# Altium schematic sheet Sheet2.SchDoc
size A4; SheetNumber: 2; SheetTotal: 3
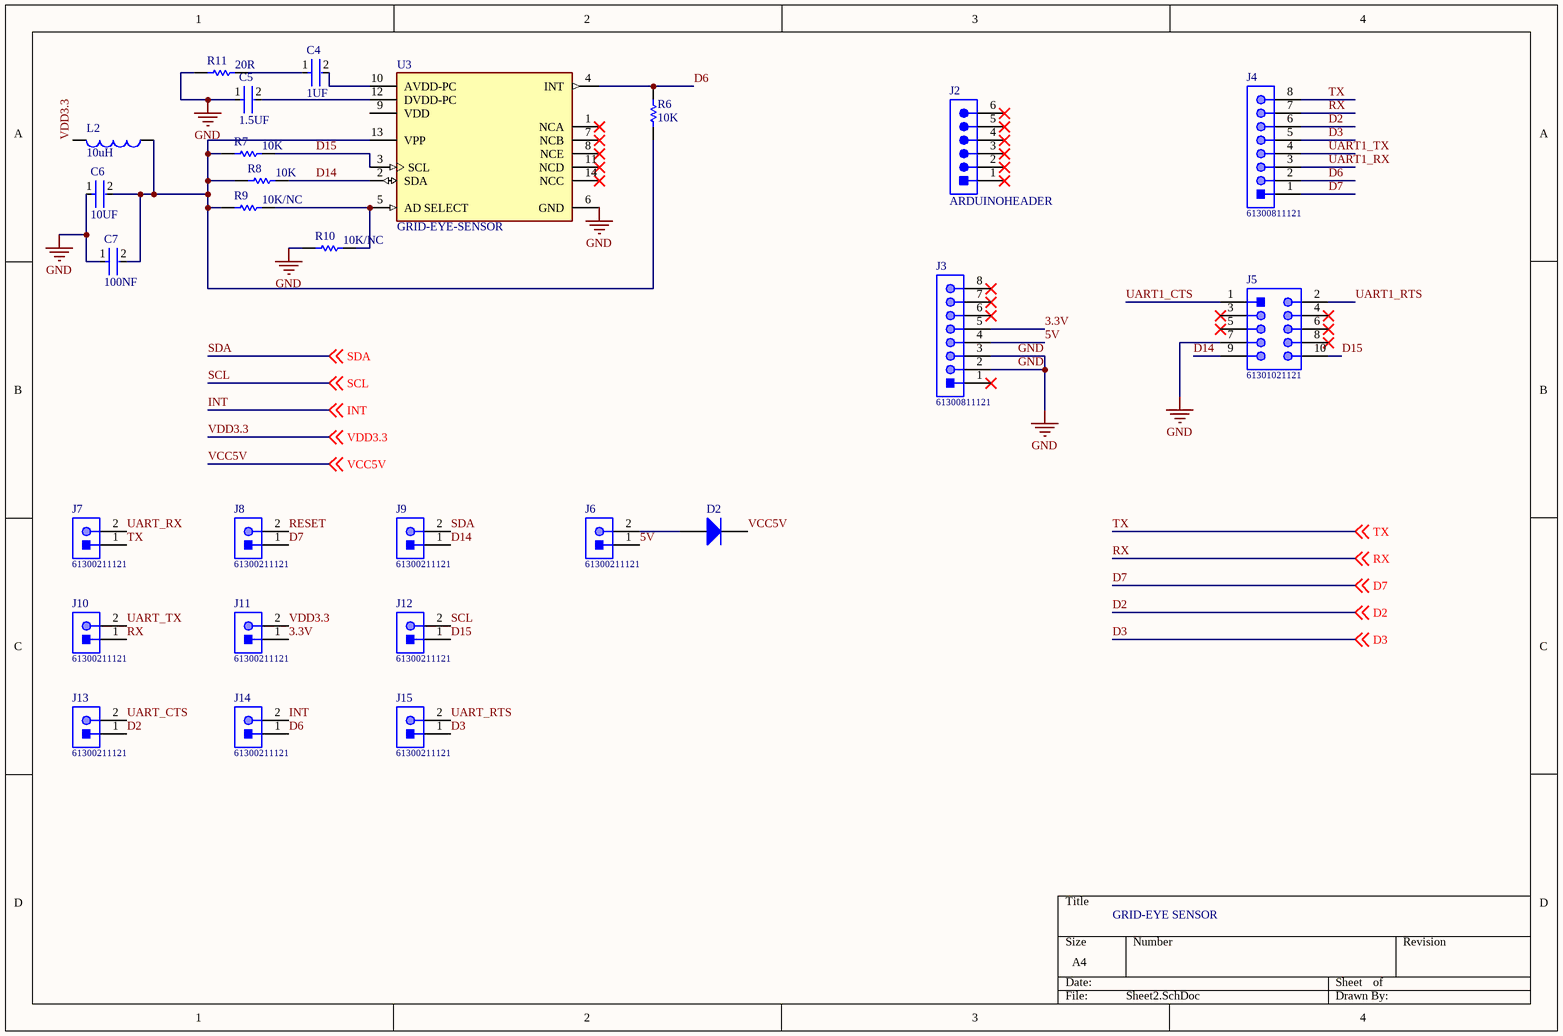
[diagram p0: Sheet2.SchDoc]

## Parts
C4  1UF  [FP-C0805C-DN-MFG]
C5  1.5UF  [FP-C0805C-DN-MFG]
C6  10UF  [FP-C0805C-DN-MFG]
C7  100NF  [FP-C0805C-DN-MFG]
D2  1N4148W-7-F  [DIOD-SOD123-2_V]  (value not drawn)
J2  ARDUINOHEADER  [TECO-640456-6_V]
J3  61300811121  [61300811121]
J4  61300811121  [61300811121]
J5  61301021121  [61301021121]
J6  61300211121  [61300211121]
J7  61300211121  [61300211121]
J8  61300211121  [61300211121]
J9  61300211121  [61300211121]
J10  61300211121  [61300211121]
J11  61300211121  [61300211121]
J12  61300211121  [61300211121]
J13  61300211121  [61300211121]
J14  61300211121  [61300211121]
J15  61300211121  [61300211121]
L2  value 10uH  [0402-A]  (hidden comment: Inductor)
R6  10K  [RESC1005X40X25NL05T10]
R7  10K  [RESC1005X40X25NL05T10]
R8  10K  [RESC1005X40X25NL05T10]
R9  10K/NC  [RESC1005X40X25NL05T10]
R10  10K/NC  [RESC1005X40X25NL05T10]
R11  20R  [RESC1005X40X25NL05T10]
U3  GRID-EYE-SENSOR  [FP-AMG8834-MFG]

## Nets
GND: C5.1 C6.1 C7.1 J3.2 J3.3 J5.7 R10.1 R11.1 U3.6(GND)
3.3V: J3.5 J11.1
5V: J3.4 J6.1
D2: J4.6 J13.1 ; off-sheet D2
D3: J4.5 J15.1 ; off-sheet D3
D6: J4.2 J14.1 R6.2 U3.4(INT)
D7: J4.1 J8.1 ; off-sheet D7
D14: J5.9 J9.1 R8.2 U3.2(SDA)
D15: J5.10 J12.1 R7.2 U3.3(SCL)
INT: J14.2 ; off-sheet INT
RESET: J8.2
RX: J4.7 J10.1 ; off-sheet RX
SCL: J12.2 ; off-sheet SCL
SDA: J9.2 ; off-sheet SDA
TX: J4.8 J7.1 ; off-sheet TX
UART1_CTS: J5.1
UART1_RTS: J5.2
UART1_RX: J4.3
UART1_TX: J4.4
UART_CTS: J13.2
UART_RTS: J15.2
UART_RX: J7.2
UART_TX: J10.2
VCC5V: D2.2(K) ; off-sheet VCC5V
VDD3.3: J11.2 L2.2 ; off-sheet VDD3.3
NetC4_1: C4.1 R11.2
NetC4_2: C4.2 U3.10(AVDD-PC)
NetC5_2: C5.2 U3.12(DVDD-PC)
NetC6_2: C6.2 C7.2 L2.1 R6.1 R7.1 R8.1 R9.1 U3.13(VPP)
NetD2_1: D2.1(A) J6.2
NetR9_2: R9.2 R10.2 U3.5(AD_SELECT)

Not connected (* = marked no-connect by the designer): J2 1* 2* 3* 4* 5* 6*; J3 1* 6* 7* 8*; J5 3* 4* 5* 6* 8*; U3 1(NCA)* 7(NCB)* 8(NCE)* 9(VDD) 11(NCD)* 14(NCC)*

## Notes on the sheet
- GRID-EYE SENSOR

## Library data of the parts
C4-C7 = CMP-2007-00279-2: CAP CER 0.1UF 50V X7R 0805; Manufacturer Part Number: C0805C104K5RACTU; Manufacturer: KEMET; Value: 0.10 μF; Description: C0805 0.10 μF X7R 30ppm/°C 10.00% 50 V; Tolerance: 0.1; Temperature Coefficient: 30ppm/°C; Material: Ceramic; Device Class L2: Capacitors; Temperature Range Low: -55°C; Voltage Rating: 50 V; Digikey Description: CAP CER 0.1UF 50V X7R 0805; Category: Cap; ComponentLink2Description: Datasheet; Octopart: https://octopart.com/c0805c104k5ractu-kemet-143926; RoHS: TRUE; ComponentLink2URL: https://content.kemet.com/datasheets/KEM_C1003_C0G_SMD.pdf; Temperature Characteristic: X7R; Temperature: -55°C to +125°C; Height: 0.88mm; Temperature Range High: +125°C; Device Class L1: Passive Components; Automotive: No; Lead Free: Yes; Ipc Land Pattern Name: CAPC200125X78; Device Class L3: Ceramic Capacitors; Mouser Description: Cap Ceramic 0.1uF 50V X7R 10% SMD 2.0 x 1.2 mm 125 C Paper T/R; Capacitance: 0.10 μF; Package: C0805C-DN
D2 = CMP-2000-04932-2: Fast Switching Diode, 100 V, 0.15 A, -65 to 150 degC, 2-Pin?SOD123, RoHS, Tape and Reel; Recovery Time: 4ns; Brand: DiodesIncorporated; Unit Weight: 0.000353oz; Max Surge Current: 2A; Peak Reverse Voltage: 100V; Ir - Reverse Current: 1uA; Vf - Forward Voltage: 1.25V; Configuration: Single; If - Forward Current: 0.15A; Product Category: Diodes-GeneralPurpose,Power,Switching; Operating Temperature Range: -65Cto+150C; Packaging: Reel; Manufacturer URL: http://www.diodes.com/; Maximum Operating Temperature: +150C; Height: 1.25mm; Minimum Operating Temperature: -65C; Product: SwitchingDiodes; Package URL: http://www.diodes.com/datasheets/ds18004.pdf; Type: SwitchingDiode; Package Reference: SOD123-2; Width: 1.7mm; Datasheet URL: http://www.farnell.com/datasheets/1915529.pdf; Datasheet Version: Rev. 24-2, 10/2013; Series: 1N4148; Factory Pack Quantity: 3000; Length: 2.85mm; RoHS: True; Manufacturer: DiodesIncorporated; Mounting Style: SMD/SMT; Package / Case: SOD-123
J2 = CMP-2000-05661-1: Male Header, Pitch 2.54 mm, 1 x 6 Position, Height 10.03 mm, Tail Length 3.56 mm, -55 to 105 degC, Bulk; Manufacturer: TE Connectivity; Contact Centerline Spacing: 0.100 / in.; Number of Contacts: 6; Current, Rating: 5 / A; Agency Approvals: CSA,UL; Material, Contact: CopperAlloy; Mounting Hole Size: 0.04 / "; Brand/Series: MTA-100Series; Pin Spacing: 0.1 / "; Mount Angle: Vertical; Contact Termination Area Plating: Tin; Angle: Straight; Primary Type: InterconnectSystem; Standards: RoHSCompliant,ELVCompliant,UL94V-0; Temperature, Operating: -55to+105 / °C; Material, Housing: Polyester; Special Features: Pinstrip; Color, Housing: White; Connector Type: MTA-100; Voltage, Rating: 250 / V; Termination: Solder; Package Reference: 640456-6; Size, Post: 0.025 / in.; Color: White; Datasheet URL: https://datasheet.ciiva.com/25618/0900766b80eb7fdd-25618163.pdf; Manufacturer URL: http://www.te.com/; Mounting Type: PCMount; Length, Pin: 0.14 / "; Type: PCBPlug; Length, Overall: 0.6 / "; Mounting Technology: ThroughHole; Number of Rows: 1; Contact Shape: Square; Contact Mating Area Plating: Tin; Datasheet Version: Rev. W, 05/2005; Number of Positions: 6; Package Description: Male Header, Pitch 2.54 mm, 1 x 6 Position, Height 10.03 mm, Tail Length 3.56 mm; Contact Plating: Tin; Length, Terminal Post: 0.14 / in.; Flammability Rating: UL94V-0
J3 J4 = CMP-1502-01076-1: THT Vertical Pin Header WR-PHD, Pitch 2.54 mm, Single Row, 8 pins; Manufacturer: Wurth Elektronik; Rated Current: 3A; Pin Number: 8; Working Voltage: 250VAC; Gender: Male; Contact Resistance: 20mOhm; Pitch: 2.54mm; Withstanding Voltage: 500VAC; Publisher: WurthElektronik; Operating Temperature: -40to105degC; Orientation: Vertical; Row Number: Single; Part Number: 61300811121; Package Reference: 61300811121; Mounting Technology: THT; Packaging: Bag; Manufacturer URL: http://www.we-online.de; Datasheet URL: https://katalog.we-online.de/em/datasheet/6130xx11121.pdf
J5 = CMP-1502-01084-1: THT Vertical Pin Header WR-PHD, Pitch 2.54 mm, Dual Row, 10 pins; Manufacturer: Wurth Elektronik; Working Voltage: 250VAC; Pitch: 2.54mm; Contact Resistance: 20mOhm; Gender: Male; Rated Current: 3A; Withstanding Voltage: 500VAC; Pin Number: 10; Operating Temperature: -40to105degC; Mounting Technology: THT; Publisher: WurthElektronik; Manufacturer URL: http://www.we-online.de; Part Number: 61301021121; Row Number: Dual; Packaging: Bag; Orientation: Vertical; Package Reference: 61301021121; Datasheet URL: https://katalog.we-online.de/em/datasheet/6130xx21121.pdf
J6-J15 = CMP-1712-00002-4: THT Vertical Pin Header WR-PHD, Pitch 2.54 mm, Single Row, 2 pins; Manufacturer: Wurth Elektronik; Rated Current: 3A; Gender: Male; Withstanding Voltage: 500VAC; Working Voltage: 250VAC; Pitch: 2.54mm; Contact Resistance: 20mOhm; Pin Number: 2; Mounting Technology: THT; Orientation: Vertical; Operating Temperature: -40to105degC; Packaging: Bag; Publisher: WurthElektronik; Datasheet URL: https://katalog.we-online.de/em/datasheet/6130xx11121.pdf; Manufacturer URL: http://www.we-online.de; Row Number: Single; Package Reference: 61300211121; Part Number: 61300211121
L2 = Inductor: Code_IEC: 1005; Published: 8-Jun-2000; LatestRevisionDate: 29-May-2009; LatestRevisionNote: IPC-7351 Footprint Added.; PackageReference: 0402-A; Publisher: Altium Limited; PackageDescription: Chip Inductor; Code_JEITA: 0402
R6-R11 = CMP-1011-00001-2: Manufacturer: Yageo / Phycomp; Part Number: RC0402JR-070RL
U3 = CMP-05551-000001-1: SENSOR DGTL 14SMD MODULE; Sensing Method: Infrared (IR); Output Type: I2C; Case/Package: SMD/SMT; Max Operating Temperature: 80°C; Min Operating Temperature: -20°C; Packaging: Tape and Reel